# Altium schematic sheet Amplifier.SchDoc
size A4; Author: Eyke Liegmann; CompanyName: Technische Universität München; Address1: Arcisstr. 21; Address2: 80333 München; Address3: GERMANY; SheetNumber: 3; SheetTotal: 3; CompanyName2: TU München
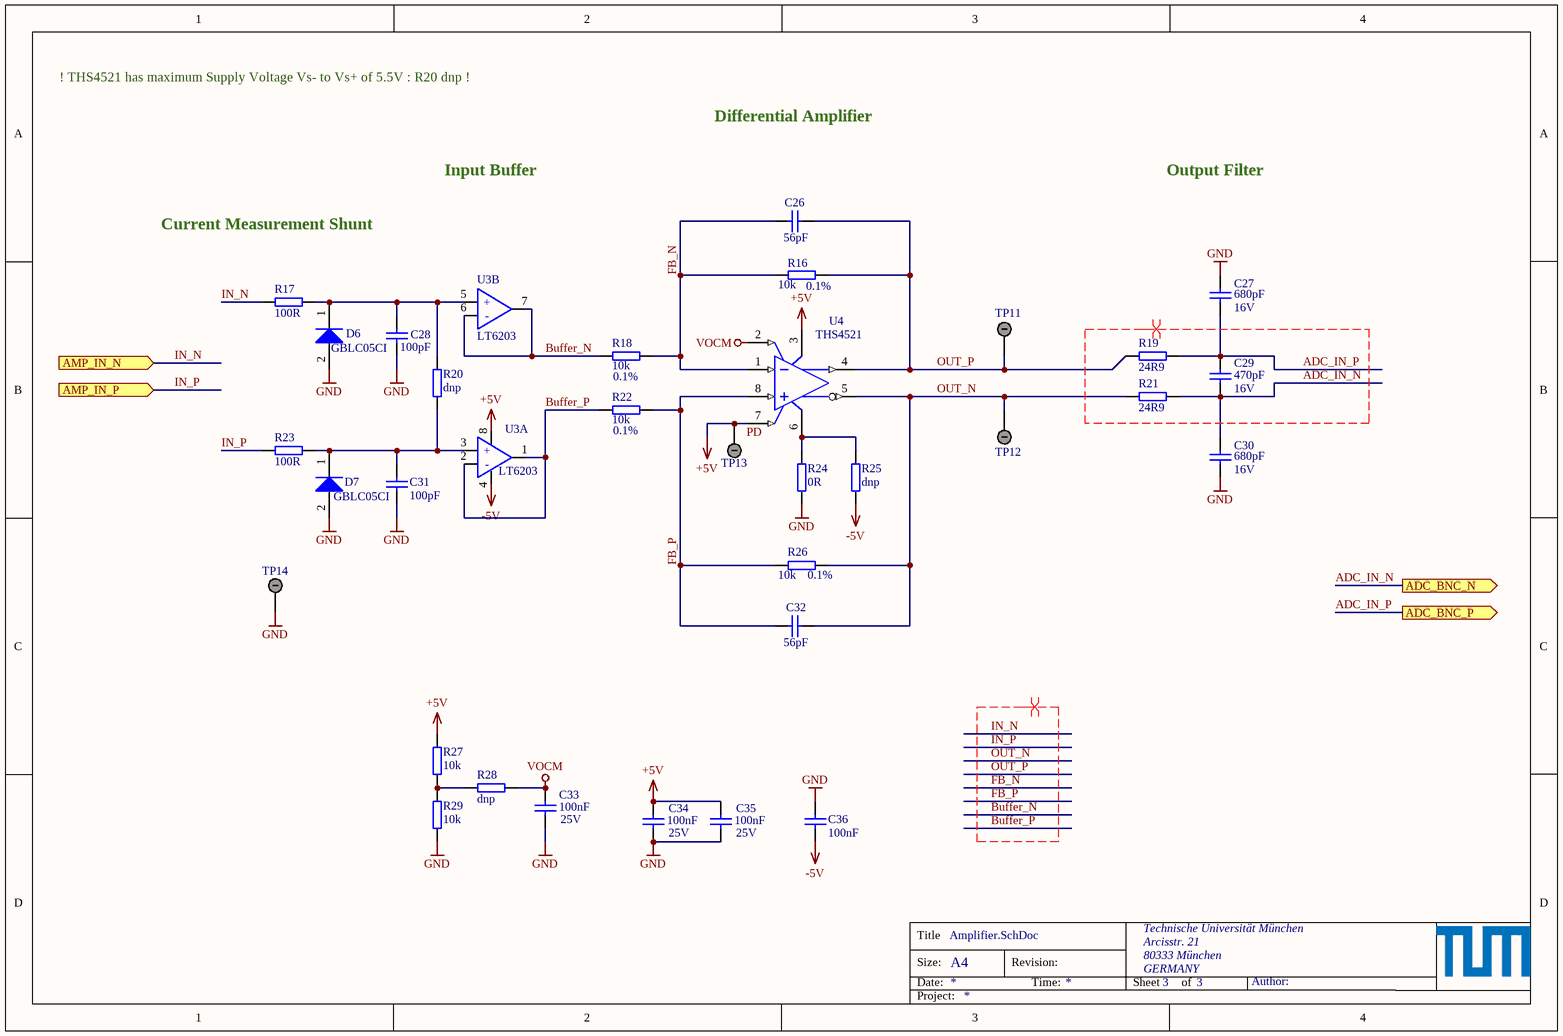
[diagram p0: Amplifier.SchDoc]

## Parts
C26  56pF  [CAPC1608X07N]
C27  680pF  Voltage: 16V  [CAPC1608X07N]
C28  100pF  [CAPC1608X07N]
C29  470pF  Voltage: 16V  [CAPC1608X07N]
C30  680pF  Voltage: 16V  [CAPC1608X07N]
C31  100pF  [CAPC1608X07N]
C32  56pF  [CAPC1608X07N]
C33  100nF  Voltage: 25V  [CAPC1608X07N]
C34  100nF  Voltage: 25V  [CAPC1608X07N]
C35  100nF  Voltage: 25V  [CAPC1608X07N]
C36  100nF  [CAPC1608X07N]
D6  GBLC05CI  [SOD-323_SuppressorDiode]
D7  GBLC05CI  [SOD-323_SuppressorDiode]
R16  10k  Tolerance: 0.1%  [RESC1608X06N]
R17  100R  [RESC1608X06N]
R18  10k  Tolerance: 0.1%  [RESC1608X06N]
R19  24R9  [RESC1608X06N]
R20  dnp  [RESC3216X65N]
R21  24R9  [RESC1608X06N]
R22  10k  Tolerance: 0.1%  [RESC1608X06N]
R23  100R  [RESC1608X06N]
R24  0R  [RESC1608X06N]
R25  dnp  [RESC1608X06N]
R26  10k  Tolerance: 0.1%  [RESC1608X06N]
R27  10k  [RESC1608X06N]
R28  dnp  [RESC1608X06N]
R29  10k  [RESC1608X06N]
TP11  AMP+  [TP_5006]  (value not drawn)
TP12  AMP-  [TP_5006]  (value not drawn)
TP13  PD  [TP_5006]  (value not drawn)
TP14  GND  [TP_5006]  (value not drawn)
U3  LT6203  [MSOP8_3x3-8N]  (parts A,B of 2)
U4  THS4521  [DGK0008A_N]

## Ports
ADC_BNC_N (out), ADC_BNC_P (out), AMP_IN_N (in), AMP_IN_P (in)

## Nets
+5V: C34.1 C35.1 R27.1 TP13.1 U3.8 U4.3(VS+) U4.7(~{PD})
-5V: C36.2 R25.1 U3.4
GND: C27.1 C28.2 C30.2 C31.2 C33.2 C34.2 C35.2 C36.1 D6.2(A) D7.2(A) R24.1 R29.2 TP14.1
VOCM: C33.1 R28.1 U4.2(VOCM)
ADC_IN_N: C29.2 C30.1 R21.2 ; port ADC_BNC_N
ADC_IN_P: C27.2 C29.1 R19.2 ; port ADC_BNC_P
Buffer_N: R18.1 U3.6(-) U3.7
Buffer_P: R22.1 U3.1 U3.2(-)
FB_N: C26.1 R16.1 R18.2 U4.1(VIN-)
FB_P: C32.1 R22.2 R26.1 U4.8(VIN+)
IN_N: R17.1 ; port AMP_IN_N
IN_P: R23.1 ; port AMP_IN_P
OUT_N: C32.2 R21.1 R26.2 TP12.1 U4.5(VOUT-)
OUT_P: C26.2 R16.2 R19.1 TP11.1 U4.4(VOUT+)
NetC28_1: C28.1 D6.1(K) R17.2 R20.2 U3.5(+)
NetC31_1: C31.1 D7.1(K) R20.1 R23.2 U3.3(+)
NetR24_2: R24.2 R25.2 U4.6(VS-)
NetR27_2: R27.2 R28.2 R29.1

## Layout directives
differential pair: ADC_IN_N, ADC_IN_P, Buffer_N, Buffer_P, FB_N, FB_P, IN_N, IN_P, OUT_N, OUT_P

## Notes on the sheet
- ! THS4521 has maximum Supply Voltage Vs- to Vs+ of 5.5V : R20 dnp !
- Input Buffer
- Differential Amplifier
- Output Filter
- Current Measurement Shunt
- Labels drawn without touching a wire or pin: PD
- Title
- Size:
- Date:
- A4
- Revision:
- Time:
- Sheet
- of
- Author:
- Project:

## Library data of the parts
C26 C32 = Cap_0603: MPN: VJ0603A560JXACW1BC; MF: Vishay; Voltage: 50V; Dielectric: C0G; Value: 56pF; Supplier 1: Mouser; Supplier 2: *; Supplier Part Number 1: 77-VJ0603A560JXACBC; Supplier Part Number 2: *; Package: 0603
C27 C30 = Cap_0603: MPN: VJ0603A681GXJCW1BC; MF: Vishay; Dielectric: C0G; Value: 680pF; Supplier 1: Mouser; Supplier 2: *; Supplier Part Number 1: 77-VJ0603A681GXJCBC; Supplier Part Number 2: *; Package: 0603
C28 C31 = Cap_0603: MPN: 885012006057; MF: Würth Elektronik; Voltage: 50V; Value: 100pF; Supplier 1: Mouser; Supplier 2: *; Supplier Part Number 1: 710-885012006057; Supplier Part Number 2: *
C29 = Cap_0603: MPN: VJ0603A471JXJCW1BC; MF: Vishay; Dielectric: C0G; Value: 470pF; Supplier 1: Mouser; Supplier 2: *; Supplier Part Number 1: 77-VJ0603A471JXJCBC; Supplier Part Number 2: *; Package: 0603
C33-C35 = Cap_0603: MPN: 885012206071; MF: Würth Elektronik; Dielectric: X7R; Value: 100nF; Supplier 1: Mouser; Supplier 2: *; Supplier Part Number 1: 710-885012206071; Supplier Part Number 2: *; Package: 0603
C36 = Cap_0603: MPN: 885012206071; MF: Würth Elektronik; Voltage: 25V; Dielectric: X7R; Value: 100nF; Supplier 1: Mouser; Supplier 2: *; Supplier Part Number 1: 710-885012206071; Supplier Part Number 2: *; Package: 0603
D6 D7 = GBLCxx: Ultra Low Capacitance TVS Array; MPN: GBLC05CI-LF-T7; MF: ProTek Devices; standoff voltage: 5.0V; breakdown voltage: 6.0V; Package: SOD-323; Supplier 1: arrow; Supplier 2: futureelectronics; Supplier Part Number 1: *; Supplier Part Number 2: *; Model: GBLC05CI; ComponentLink1Description: Datasheet; ComponentLink1URL: https://static6.arrow.com/aropdfconversion/cf1b73a38d87e210bfa153441e03466b149f09ba/gblci.pdf
R16 R18 R22 R26 = R_0603: MPN: RE0603BRE0710KL; MF: Yageo; Value: 10k; Supplier 1: Mouser; Supplier Part Number 1: 603-RE0603BRE0710KL; Package: 0603
R17 R23 = R_0603: MPN: AC0603FR-13100RL; MF: Yageo; Tolerance: 1%; Value: 100R; Supplier 1: Mouser; Supplier Part Number 1: 603-AC0603FR-13100RL; Package: 0603
R19 R21 = R_0603: MPN: RC0603FR-1324R9L; MF: Yageo; Value: 24R9; Supplier 1: Mouser; Supplier Part Number 1: 603-RC0603FR-1324R9L; Package: 0603
R20 = R_1206: WID SMD 1M 5% 0,25W; MPN: APC1206B200RN; AN: 22757; possibleValue: 200R; Mixed: SMT; Preferred: Yes; MF: ARCOL/Ohmite; Case: 1206; Technology: TK100; Tolerance: 5%; Supplier 1: Mouser; Supplier Part Number 1: 284-APC1206B200RN; Value: dnp
R24 = R_0603: MPN: CRCW06030000Z0EBC; MF: Vishay / Dale; Value: 0R; Supplier 1: Mouser; Supplier Part Number 1: 71-CRCW06030000Z0EBC; Package: 0603
R25 R28 = R_0603: Value: dnp; Package: 0603
R27 R29 = R_0603: MPN: CRCW060310K0FKEAC; MF: Vishay / Dale; Value: 10k; Supplier 1: Mouser; Supplier Part Number 1: 71-CRCW060310K0FKEAC; Package: 0603
TP11-TP14 = 5006: Test Point;  Compact;  THM;  PC;  .350 L;  .125 OD;  Heat Resistant Nylon 46;  Black; Manufacturer: Keystone Electronics; Body Material: PBT; Plating: Silver; Number of Ports: 1; Outside Diameter: 3.18mm; Inside Diameter: 1.78mm; Hole Diameter: 1.6mm; Supplier 1: Mouser; Manufacturer Part Number: 5006; RoHS: Yes; Category: Connectors; Stock 1: 203116; Mount: PCB,Through Hole; Material: Nylon,Bronze,Silver; Contact Material: Bronze; Contact Plating: Tin,Silver; Color: Black; Housing Color: Black; Package Quantity: 100; Packaging: Bulk; Orientation: Straight; Length: 8.89mm; Height: 0.35inch; Lead Free: Lead Free; REACH SVHC: No SVHC; Flammability Rating: UL94 V-0; ComponentLink1URL: https://datasheet.ciiva.com/1123/m60-2p60-1123808.pdf?src-supplier=Newark; ComponentLink1Description: https://datasheet.ciiva.com/1123/m60-2p60-1123808.pdf?src-supplier=Newark; ComponentLink2URL: https://datasheet.ciiva.com/1454/1718283-1454829.pdf?src-supplier=Element14; ComponentLink2Description: https://datasheet.ciiva.com/1454/1718283-1454829.pdf?src-supplier=Element14; ComponentLink3URL: https://datasheet.ciiva.com/11744/0900766b8009b7c7-11744947.pdf?src-supplier=RSComponents; ComponentLink3Description: https://datasheet.ciiva.com/11744/0900766b8009b7c7-11744947.pdf?src-supplier=RSComponents; ComponentLink4URL: https://datasheet.ciiva.com/2917/m60-2p60-2917629.pdf?src-supplier=Digi-Key; ComponentLink4Description: https://datasheet.ciiva.com/2917/m60-2p60-2917629.pdf?src-supplier=Digi-Key; ComponentLink5URL: https://datasheet.ciiva.com/16883/70182825-16883963.pdf?src-supplier=Allied+Electronics; ComponentLink5Description: https://datasheet.ciiva.com/16883/70182825-16883963.pdf?src-supplier=Allied+Electronics; Supplier Part Number 1: 534-5006
U3 = LT6203_MSOP8: 2 Ch Low Noise, Low Power OpAmp; MPN: LT6203CMS8#PBF; MF: Analog Devices / Linear Technology; Created: Kreppel_20190830; Package: MSOP-8; Supplier 1: Mouser; Supplier Part Number 1: 584-LT6203CMS8#PBF
U4 = THS4521IDGKR: IC AMP RRO NEG OUT VLP 8VSSOP (Single Channel fully differential Amplifier); Manufacturer: Texas Instruments; Min Dual Supply Voltage: 1.5V; Max Dual Supply Voltage: 2.75V; Number of Channels: 1; Voltage Gain: 119dB; Slew Rate: 490V/µs; Max I/O Voltage: 2mV; Max Supply Voltage: 5.5V; Min Supply Voltage: 2.5V; Unity Gain Bandwidth Product: 95MHz; Common Mode Rejection Ratio: 80dB; Operating Supply Voltage: 5V; Bandwidth: 145MHz; Nominal Supply Current: 1.14mA; Input Bias Current: 900nA; Output Current per Channel: 55mA; Supplier 1: Mouser; Manufacturer Part Number: THS4521IDGKR; RoHS: Yes; Category: Amplifiers - Op Amps, Buffer, Instrumentation; Stock 1: 12114; Pricing 1: 1=2,55000, 10=2,29000, 25=2,16000, 100=1,78000, 250=1,59000, 500=1,54000, 1000=1,28000, 2500=1,25000, 1=2,83000, 10=2,54000, 25=2,40000, 100=1,98000, 250=1,77000, 500=1,71000 (EUR); Case/Package: VSSOP; Number of Pins: 8; Weight: 0.000935oz; Min Operating Temperature: -40°C; Max Operating Temperature: 85°C; Packaging: Tape and Reel; Package Quantity: 2500; -3db Bandwidth: 145MHz; Gain Bandwidth Product: 95MHz; Input Offset Voltage (Vos): 2mV; Operating Supply Current: 1.14mA; Power Supply Rejection Ratio (PSRR): 80dB; Number of Circuits: 1; Number of Elements: 1; Number of Amplifiers: 1; Radiation Hardening: No; Lead Free: Lead Free; REACH SVHC: No SVHC; ComponentLink1URL: https://datasheet.ciiva.com/14456/sbos458f-14456592.pdf?src-supplier=Avnet; ComponentLink1Description: https://datasheet.ciiva.com/14456/sbos458f-14456592.pdf?src-supplier=Avnet; ComponentLink2URL: https://datasheet.ciiva.com/18622/ths4521-18622155.pdf?src-supplier=Digi-Key; ComponentLink2Description: https://datasheet.ciiva.com/18622/ths4521-18622155.pdf?src-supplier=Digi-Key; ComponentLink3URL: https://datasheet.ciiva.com/18622/ths4521-18622156.pdf?src-supplier=Digi-Key; ComponentLink3Description: https://datasheet.ciiva.com/18622/ths4521-18622156.pdf?src-supplier=Digi-Key; ComponentLink4URL: https://datasheet.ciiva.com/18622/ths4521-18622157.pdf?src-supplier=Digi-Key; ComponentLink4Description: https://datasheet.ciiva.com/18622/ths4521-18622157.pdf?src-supplier=Digi-Key; Supplier Part Number 1: 595-THS4521IDGKR